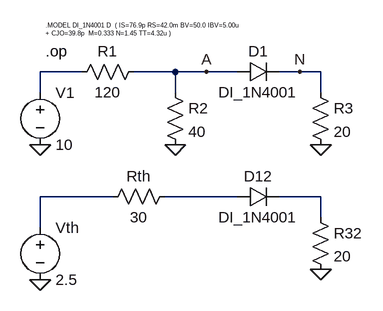
[diagram p0: schematic Diodo 1N4001 (Thevenin).asc]
Diodo 1N4001 (Thevenin).asc, the LTspice schematic file:
Version 4
SHEET 1 880 680
WIRE 48 80 -16 80
WIRE 192 80 128 80
WIRE 240 80 192 80
WIRE 288 80 240 80
WIRE 384 80 352 80
WIRE 416 80 384 80
WIRE -16 112 -16 80
WIRE 192 112 192 80
WIRE 416 112 416 80
WIRE 96 272 -16 272
WIRE 288 272 176 272
WIRE 416 272 352 272
WIRE 416 304 416 272
WIRE -16 320 -16 272
FLAG -16 192 0
FLAG 416 192 0
FLAG 192 192 0
FLAG 416 384 0
FLAG -16 400 0
FLAG 240 80 A
FLAG 384 80 N
SYMBOL diode 288 96 R270
WINDOW 0 32 32 VTop 2
WINDOW 3 0 32 VBottom 2
SYMATTR InstName D1
SYMATTR Value DI_1N4001
SYMBOL voltage -16 96 R0
SYMATTR InstName V1
SYMATTR Value 10
SYMBOL res 144 64 R90
WINDOW 0 0 56 VBottom 2
WINDOW 3 32 56 VTop 2
SYMATTR InstName R1
SYMATTR Value 120
SYMBOL res 176 96 R0
SYMATTR InstName R2
SYMATTR Value 40
SYMBOL res 400 96 R0
SYMATTR InstName R3
SYMATTR Value 20
SYMBOL voltage -16 304 R0
SYMATTR InstName Vth
SYMATTR Value 2.5
SYMBOL res 192 256 R90
WINDOW 0 0 56 VBottom 2
WINDOW 3 32 56 VTop 2
SYMATTR InstName Rth
SYMATTR Value 30
SYMBOL diode 288 288 R270
WINDOW 0 32 32 VTop 2
WINDOW 3 0 32 VBottom 2
SYMATTR InstName D12
SYMATTR Value DI_1N4001
SYMBOL res 400 288 R0
SYMATTR InstName R32
SYMATTR Value 20
TEXT -8 8 Left 0 !.MODEL DI_1N4001 D  ( IS=76.9p RS=42.0m BV=50.0 IBV=5.00u\n+ CJO=39.8p  M=0.333 N=1.45 TT=4.32u )
TEXT -8 48 Left 2 !.op

The netlist it stands for:
* Diodo 1N4001 (Thevenin).asc
D1 A N DI_1N4001
V1 N001 0 10
R1 A N001 120
R2 A 0 40
R3 N 0 20
Vth N002 0 2.5
Rth N003 N002 30
D12 N003 N004 DI_1N4001
R32 N004 0 20
.model D D
.lib standard.dio
.MODEL DI_1N4001 D  ( IS=76.9p RS=42.0m BV=50.0 IBV=5.00u
+ CJO=39.8p  M=0.333 N=1.45 TT=4.32u )
.op
.backanno
.end